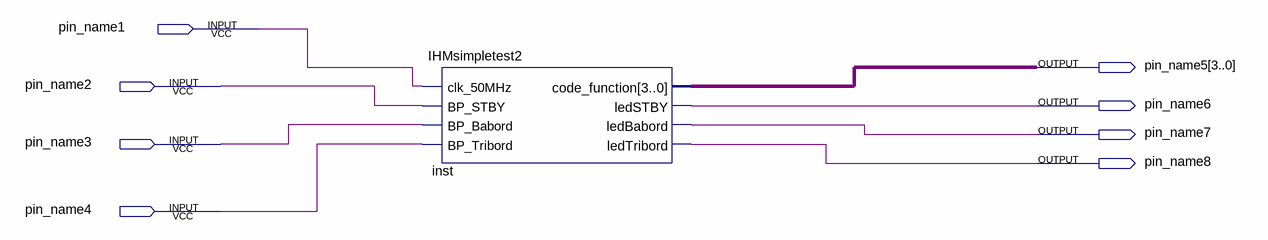
[diagram p0: schematic sheet]
// Quartus schematic Block2.bdf as structural Verilog: 1 symbols, 8 pins
module Block2 (
  input  pin_name1,
  input  pin_name2,
  input  pin_name3,
  input  pin_name4,
  output [3:0] pin_name5,
  output pin_name6,
  output pin_name7,
  output pin_name8
);

  IHMsimpletest2 inst (
    .clk_50MHz(pin_name1), .BP_STBY(pin_name2), .BP_Babord(pin_name3), .BP_Tribord(pin_name4),
    .code_function(pin_name5), .ledSTBY(pin_name6), .ledBabord(pin_name7), .ledTribord(pin_name8));
endmodule
